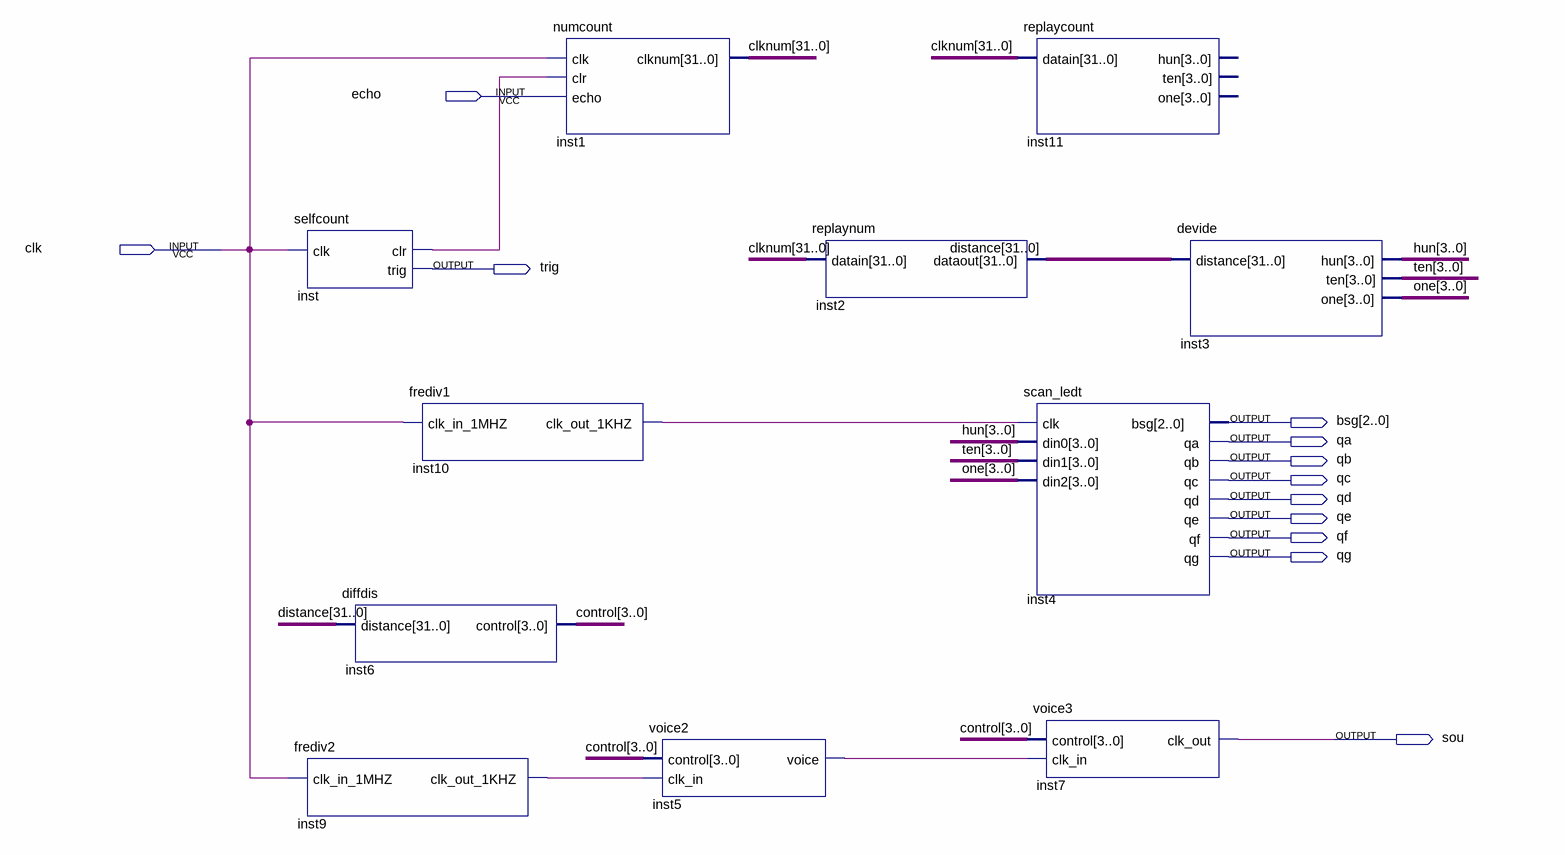
[diagram p0: schematic sheet]
// Quartus schematic manage.bdf as structural Verilog: 11 symbols, 12 pins
module manage (
  input  echo,
  input  clk,
  output trig,
  output [2:0] bsg,
  output qa,
  output qb,
  output qc,
  output qd,
  output qe,
  output qf,
  output qg,
  output sou
);

  wire inst5_voice, inst9_clk_out_1khz, inst10_clk_out_1khz, inst_clr;
  wire [3:0] control, hun, one, ten;
  wire [31:0] clknum, distance;

  selfcount inst (.clk(clk), .clr(inst_clr), .trig(trig));
  frediv2 inst9 (.clk_in_1MHZ(clk), .clk_out_1KHZ(inst9_clk_out_1khz));
  diffdis inst6 (.distance(distance), .control(control));
  frediv1 inst10 (.clk_in_1MHZ(clk), .clk_out_1KHZ(inst10_clk_out_1khz));
  numcount inst1 (.clk(clk), .clr(inst_clr), .echo(echo), .clknum(clknum));
  voice2 inst5 (.control(control), .clk_in(inst9_clk_out_1khz), .voice(inst5_voice));
  replaynum inst2 (.datain(clknum), .dataout(distance));
  replaycount inst11 (.datain(clknum));  // open: hun, ten, one
  scan_ledt inst4 (
    .clk(inst10_clk_out_1khz), .din0(hun), .din1(ten), .din2(one), .bsg(bsg), .qa(qa), .qb(qb), .qc(qc),
    .qd(qd), .qe(qe), .qf(qf), .qg(qg));
  voice3 inst7 (.control(control), .clk_in(inst5_voice), .clk_out(sou));
  devide inst3 (.distance(distance), .hun(hun), .ten(ten), .one(one));
endmodule
